# EAGLE design schematic (EAGLE 7.6.0)
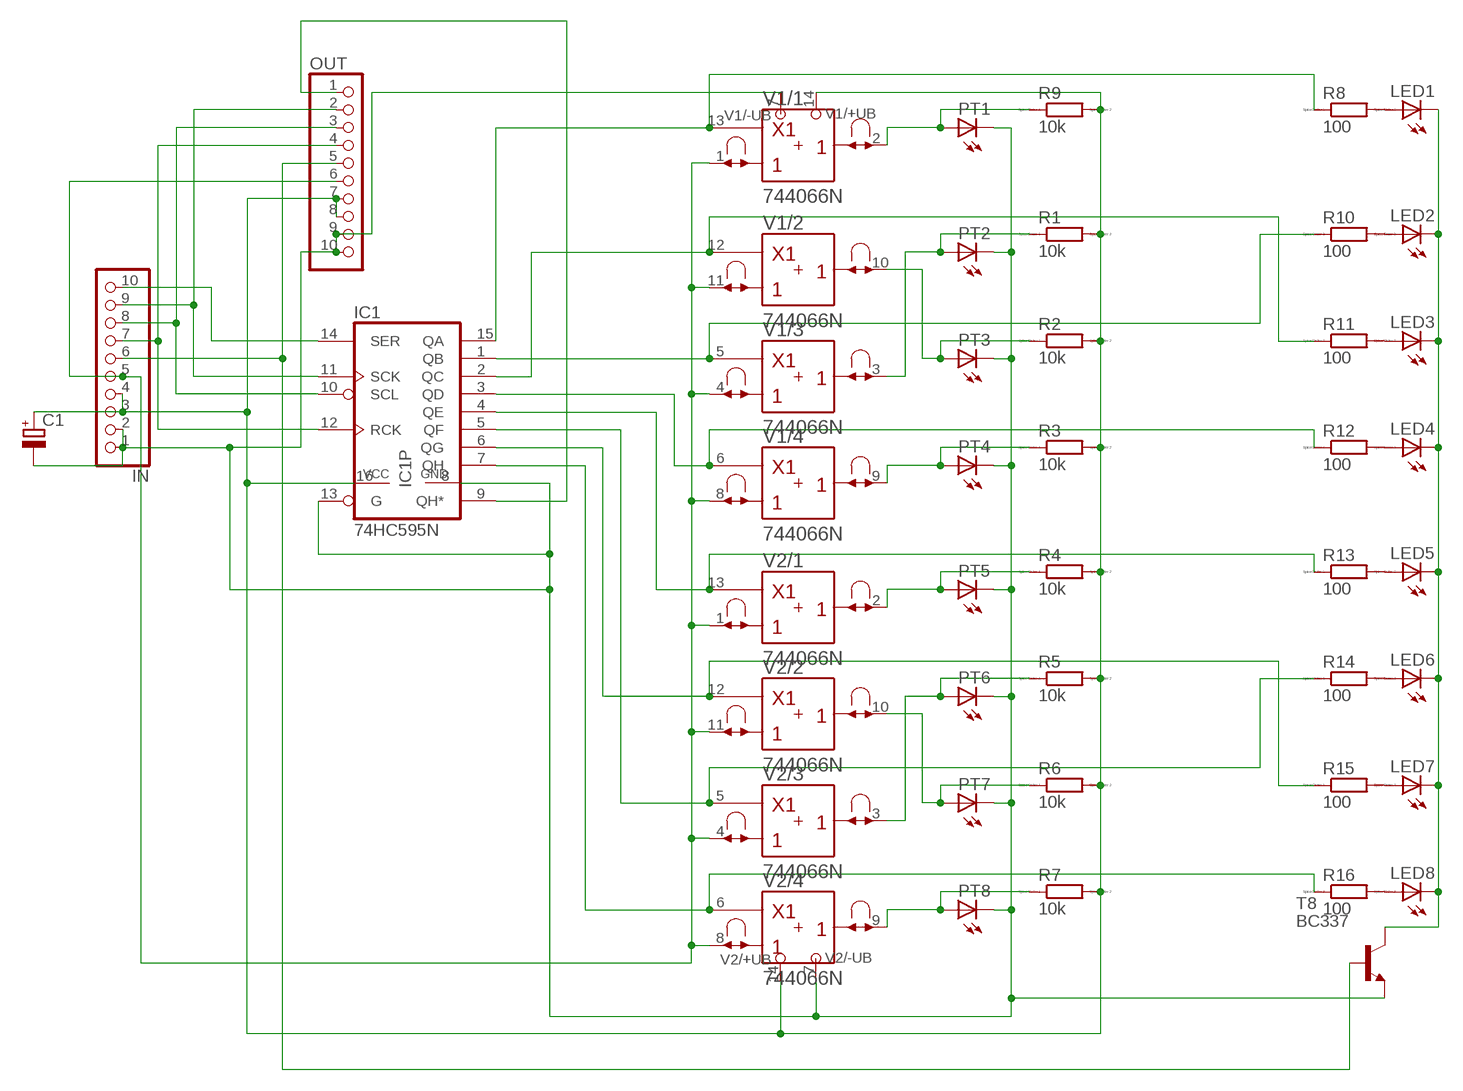
[diagram p0: schematic, sheet 1]

## Parts
C1  CPOL-EUE5-10.5  [E5-10,5]
IC1  74HC595N  [DIL16]
IN  PINHD-1X10/90  [1X10/90]
LED1  LED5MM  [LED5MM]
LED2  LED5MM  [LED5MM]
LED3  LED5MM  [LED5MM]
LED4  LED5MM  [LED5MM]
LED5  LED5MM  [LED5MM]
LED6  LED5MM  [LED5MM]
LED7  LED5MM  [LED5MM]
LED8  LED5MM  [LED5MM]
OUT  PINHD-1X10/90  [1X10/90]
PT1  LED5MM  [LED5MM]
PT2  LED5MM  [LED5MM]
PT3  LED5MM  [LED5MM]
PT4  LED5MM  [LED5MM]
PT5  LED5MM  [LED5MM]
PT6  LED5MM  [LED5MM]
PT7  LED5MM  [LED5MM]
PT8  LED5MM  [LED5MM]
R1  10k  R0204/7  [0204/7]
R2  10k  R0204/7  [0204/7]
R3  10k  R0204/7  [0204/7]
R4  10k  R0204/7  [0204/7]
R5  10k  R0204/7  [0204/7]
R6  10k  R0204/7  [0204/7]
R7  10k  R0204/7  [0204/7]
R8  100  R0204/7  [0204/7]
R9  10k  R0204/7  [0204/7]
R10  100  R0204/7  [0204/7]
R11  100  R0204/7  [0204/7]
R12  100  R0204/7  [0204/7]
R13  100  R0204/7  [0204/7]
R14  100  R0204/7  [0204/7]
R15  100  R0204/7  [0204/7]
R16  100  R0204/7  [0204/7]
T8  BC337  [TO92]
V1  744066N  [DIL14]
V2  744066N  [DIL14]

## Nets
GND: C1.- IC1.8(GND) IC1.13(G) IN.1 IN.2 OUT.9 OUT.10 PT1.K(C) PT2.K(C) PT3.K(C) PT4.K(C) PT5.K(C) PT6.K(C) PT7.K(C) PT8.K(C) T8.1(E) V1.7(/-UB:-UB) V2.7(/-UB:-UB)
N$1: IC1.15(QA) R8.1 V1.13(/1:C)
N$2: IC1.5(QF) R14.1 V2.5(/3:C)
N$3: IN.6 OUT.5 T8.2(B)
N$4: IC1.3(QD) R12.1 V1.6(/4:C)
N$5: IC1.4(QE) R13.1 V2.13(/1:C)
N$6: IC1.6(QG) R15.1 V2.12(/2:C)
N$8: IC1.7(QH) R16.1 V2.6(/4:C)
N$10: IC1.9(QH*) OUT.1
N$11: IC1.1(QB) R10.1 V1.5(/3:C)
N$12: PT8.A R7.1 V2.9(/4:B)
N$13: PT7.A R6.1 V2.10(/2:B)
N$14: PT6.A R5.1 V2.3(/3:B)
N$15: PT5.A R4.1 V2.2(/1:B)
N$16: PT4.A R3.1 V1.9(/4:B)
N$17: PT3.A R2.1 V1.10(/2:B)
N$18: PT2.A R1.1 V1.3(/3:B)
N$19: PT1.A R9.1 V1.2(/1:B)
N$20: LED1.A R8.2
N$21: IC1.10(SCL) IN.8 OUT.3
N$23: IC1.12(RCK) IN.7 OUT.4
N$24: LED2.A R10.2
N$25: IC1.11(SCK) IN.9 OUT.2
N$26: IC1.14(SER) IN.10
N$27: LED3.A R11.2
N$28: LED4.A R12.2
N$29: LED5.A R13.2
N$30: LED6.A R14.2
N$31: LED7.A R15.2
N$32: LED8.A R16.2
N$33: LED1.K(C) LED2.K(C) LED3.K(C) LED4.K(C) LED5.K(C) LED6.K(C) LED7.K(C) LED8.K(C) T8.3(C)
N$34: IC1.2(QC) R11.1 V1.12(/2:C)
N$35: IN.5 OUT.6 V1.1(/1:A) V1.4(/3:A) V1.8(/4:A) V1.11(/2:A) V2.1(/1:A) V2.4(/3:A) V2.8(/4:A) V2.11(/2:A)
VCC: C1.+ IC1.16(VCC) IN.3 IN.4 OUT.7 OUT.8 R1.2 R2.2 R3.2 R4.2 R5.2 R6.2 R7.2 R9.2 V1.14(/+UB:+UB) V2.14(/+UB:+UB)

## Library data of the parts
C1 = rcl:CPOL-EU: POLARIZED CAPACITOR, European symbol
IC1 = 74xx-eu:74*595: 8-bit SHIFT REGISTER, output latch
IN OUT = pinhead:PINHD-1X10: PIN HEADER
LED1-LED8 PT1-PT8 = led:LED: LED OSRAM: - CHIPLED LG R971, LG N971, LY N971, LG Q971, LY Q971, LO R971, LY R971 LH N974, LH R974 LS Q976, LO Q976, LY Q976 LO Q996 - Hyper CHIPLED LW Q18S LB Q993, LB Q99A, LB R99A - SideLED LS A670, LO A670, LY A670, LG A670, LP A670 LB A673, LV A673, LT A673, LW A673 LH A674 LY A675 LS A676, LA A676, LO A676, LY A676, LW A676 LS A679, LY A679, LG A679 - Hyper Micro SIDELED® LS Y876, LA Y876, LO Y876, LY Y876 LT Y87S - SmartLED LW L88C, LW L88S LB L89C, LB L89S, LG L890 LS L89K, LO L89K, LY L89K LS L896, LA L896, LO L896, LY L896 - TOPLED LS T670, LO T670, LY T670, LG T670, LP T670 LSG T670, LSP T670, LSY T670, LOP T670, LYG T670 LG T671, LOG T671, LSG T671 LB T673, LV T673, LT T673, LW T673 LH T674 LS T676, LA T676, LO T676, LY T676, LB T676, LH T676, LSB T676, LW T676 LB T67C, LV T67C, LT T67C, LS T67K, LO T67K, LY T67K, LW E67C LS E67B, LA E67B, LO E67B, LY E67B, LB E67C, LV E67C, LT E67C LW T67C LS T679, LY T679, LG T679 LS T770, LO T770, LY T770, LG T770, LP T770 LB T773, LV T773, LT T773, LW T773 LH T774 LS E675, LA E675, LY E675, LS T675 LS T776, LA T776, LO T776, LY T776, LB T776 LHGB T686 LT T68C, LB T68C - Hyper Mini TOPLED® LB M676 - Mini TOPLED Santana® LG M470 LS M47K, LO M47K, LY M47K Source: http://www.osram.convergy.de LUXEON: - LUMILED® LXK2-PW12-R00, LXK2-PW12-S00, LXK2-PW14-U00, LXK2-PW14-V00 LXK2-PM12-R00, LXK2-PM12-S00, LXK2-PM14-U00 LXK2-PE12-Q00, LXK2-PE12-R00, LXK2-PE12-S00, LXK2-PE14-T00, LXK2-PE14-U00 LXK2-PB12-K00, LXK2-PB12-L00, LXK2-PB12-M00, LXK2-PB14-N00, LXK2-PB14-P00, LXK2-PB14-Q00 LXK2-PR12-L00, LXK2-PR12-M00, LXK2-PR14-Q00, LXK2-PR14-R00 LXK2-PD12-Q00, LXK2-PD12-R00, LXK2-PD12-S00 LXK2-PH12-R00, LXK2-PH12-S00 LXK2-PL12-P00, LXK2-PL12-Q00, LXK2-PL12-R00 Source: www.luxeon.com KINGBRIGHT: KA-3528ASYC Source: www.kingbright.com
R1-R16 = eagle-ltspice:R: RESISTOR, European symbol; SPICEMODEL: NONE; SPICEPREFIX: R
T8 = transistor:BC337: NPN TRANSISTOR
V1 V2 = 74ttl-din:74*4066: Quad analog SWITCH

## Net classes
0 default: drill 0.6 mm, clearance 0.015 mm

## Board
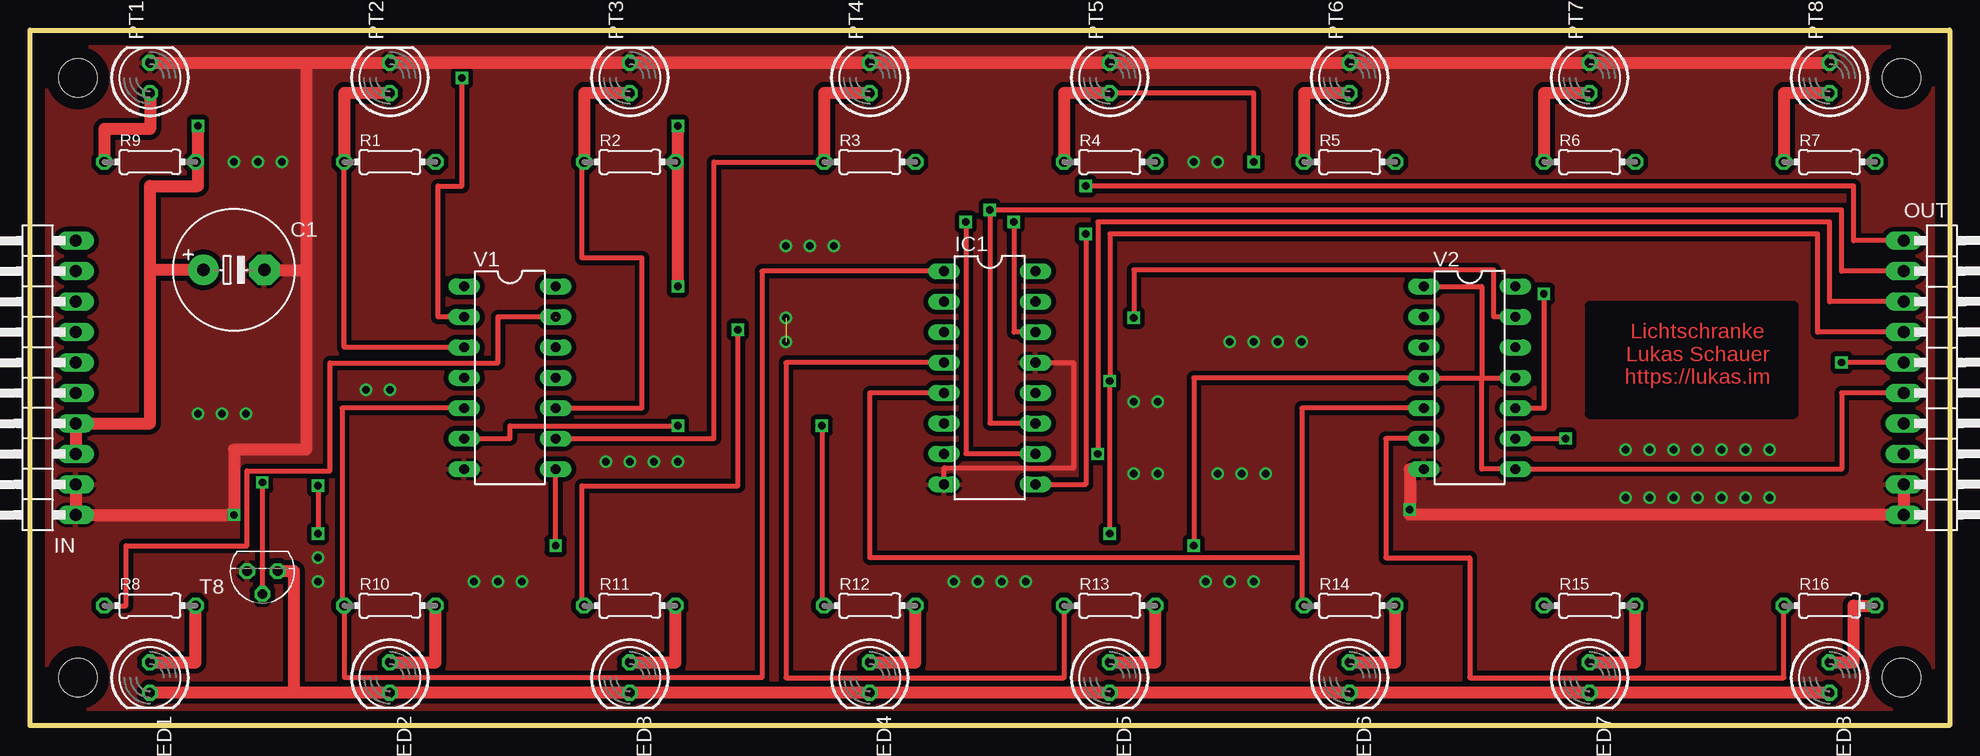
[diagram p1: board, top side]
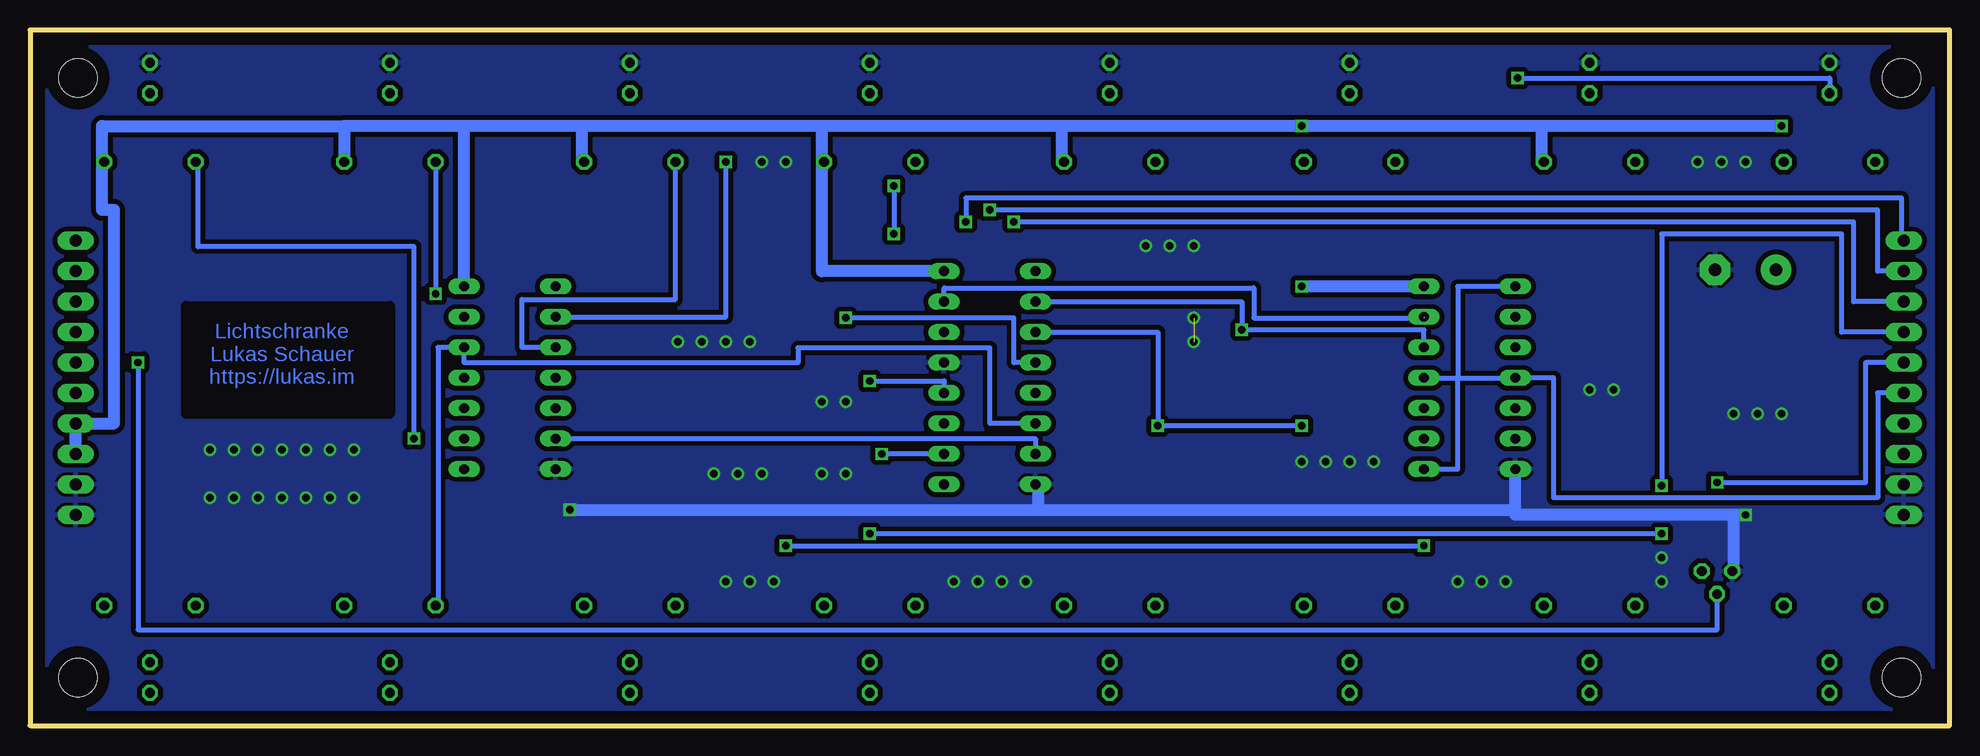
[diagram p2: board, bottom side, seen from below]

Size 160 x 58 mm. Coordinates in mm from the lower left corner, seen from the top.
Outline: 0,0 0,58 160,58 160,0 0,0
Copper layers (1*16): Top 0.035mm / dielectric 1.5mm / Bottom 0.035mm
Design rules "default *": minimum track width 10mil, minimum drill 0.6mm, track to track 8mil, track to pad 8mil, pad to pad 8mil, via to via 8mil, smd to smd 8mil, copper to edge 40mil, drill to drill 8mil, minimum pad ring 10mil, minimum via ring 8mil, stop-mask expansion 4mil, vias tented up to drill 0mil, thermal gap 10mil
Holes 3.2 mm at 4,54 4,4 156,54 156,4

### Footprints (pad centres in the part's own frame; a part is rotated, then mirrored left to right if it is on the bottom)
E5-10,5 = drill 1.016 pad 2.54: + -2.54,0 | drill 1.016 pad 2.54 octagon: - 2.54,0
DIL16 = drill 0.813 long: 1 -8.89,-3.81; 2 -6.35,-3.81; 3 -3.81,-3.81; 4 -1.27,-3.81; 5 1.27,-3.81; 6 3.81,-3.81; 7 6.35,-3.81; 8 8.89,-3.81; 9 8.89,3.81; 10 6.35,3.81; 11 3.81,3.81; 12 1.27,3.81; 13 -1.27,3.81; 14 -3.81,3.81; 15 -6.35,3.81; 16 -8.89,3.81
1X10/90 = drill 1.016 long: 1 -11.43,-3.81; 2 -8.89,-3.81; 3 -6.35,-3.81; 4 -3.81,-3.81; 5 -1.27,-3.81; 6 1.27,-3.81; 7 3.81,-3.81; 8 6.35,-3.81; 9 8.89,-3.81; 10 11.43,-3.81
LED5MM = drill 0.813 octagon: A -1.27,0; K 1.27,0
0204/7 = drill 0.813 octagon: 1 -3.81,0; 2 3.81,0
TO92 = drill 0.813 octagon: 1 1.27,0; 2 0,1.905; 3 -1.27,0
DIL14 = drill 0.813 long: 1 -7.62,-3.81; 2 -5.08,-3.81; 3 -2.54,-3.81; 4 0,-3.81; 5 2.54,-3.81; 6 5.08,-3.81; 7 7.62,-3.81; 8 7.62,3.81; 9 5.08,3.81; 10 2.54,3.81; 11 0,3.81; 12 -2.54,3.81; 13 -5.08,3.81; 14 -7.62,3.81

### Placement (x,y rotation side)
C1  17,38 0 top
IC1  80,29 270 top
IN  0,29 90 top
LED1  10,4 270 top
LED2  30,4 270 top
LED3  50,4 270 top
LED4  70,4 270 top
LED5  90,4 270 top
LED6  110,4 270 top
LED7  130,4 270 top
LED8  150,4 270 top
OUT  160,29 270 top
PT1  10,54 90 top
PT2  30,54 90 top
PT3  50,54 90 top
PT4  70,54 90 top
PT5  90,54 90 top
PT6  110,54 90 top
PT7  130,54 90 top
PT8  150,54 90 top
R1  30,47 0 top
R2  50,47 0 top
R3  70,47 0 top
R4  90,47 0 top
R5  110,47 0 top
R6  130,47 0 top
R7  150,47 0 top
R8  10,10 0 top
R9  10,47 0 top
R10  30,10 0 top
R11  50,10 0 top
R12  70,10 0 top
R13  90,10 0 top
R14  110,10 0 top
R15  130,10 0 top
R16  150,10 0 top
T8  19.37,12.87 180 top
V1  40,29 270 top
V2  120,29 270 top

### Tracks (layer width: path | path; a pad name or v marks a point on that pad's centre or on a via)
GND  (via drill 0.6)  (1 unrouted)
  Top 0.406: IC1.13 87,30.27 87,21.5 76.19,21.5 IC1.8
  Top 1: PT1.K 23,55.27 | 23,55.27 PT2.K | PT2.K PT3.K PT4.K PT5.K | PT5.K PT6.K PT7.K PT8.K | IN.2 IN.1 v17,17.57 17,23 23,23 23,38 | V2.7 115,21.38 v115,18 115,17.57 OUT.10 OUT.9 | PT5.K PT2.K | 23,55.27 23,38 | C1.- 23,38
  Bottom 1: IC1.8 76,20.11 76,18 | 76,18 36.19,18 | 36.19,18 V1.7 | v115,18 76,18 | v17,17.57 18,17.57 | 18,17.57 36.19,17.57 36.19,18 | T8.1 18,12.87 18,17.57
  other vias: 133,23 135,23 137,23 139,23 141,23 143,23 145,23 145,19 143,19 141,19 139,19 135,19 137,19 133,19 77,12 79,12 81,12 83,12 98,12 100,12 102,12 99,21 101,21 103,21 106,32 104,32 102,32 100,32 94,27 92,27 94,21 92,21 24,14 24,12 48,22 50,22 52,22 54,22 30,28 28,28 97,47 99,47 17,47 19,47 21,47 14,26 16,26 18,26 37,12 39,12 41,12 63,40 65,40 67,40 63,34 63,32
  pour Bottom (isolate 0.406): 0,58 160,58 160,0 0,0
  pour Top (isolate 0.406): 0,58 160,58 160,0 0,0
N$1  (1 unrouted)
  Top 0.406: R8.1 8,10 8,15 18.1,15 18.1,21.25 25,21.25 25,30.25 39,30.25 39,34.08 V1.13
  Bottom 0.406: 43.81,34 58,34 58,36.5 83.81,36.5 IC1.15
N$2
  Top 0.406: V2.5 106,26.46 106,14 | 106,14 106,10 | 106,14 70,14 70,27.73 IC1.5
  Top 1: 106,10 R14.1
N$3  (via drill 0.6)
  Top 0.406: v19.37,20.27 T8.2 19.37,11 | OUT.5 v151,30.27
  Bottom 0.406: IN.6 7,30.27 7,20.27 v19.37,20.27 | v151,30.27 151,8 19.37,8 T8.2
N$4  (via drill 0.6)
  Top 0.406: v66,25 66,10 | V1.6 40,23.92 40,25 v54,25
  Top 1: 66,10 R12.1
  Bottom 0.406: IC1.3 66,32.81 v66,25 v54,25
N$5  (via drill 0.6)
  Top 0.406: IC1.4 63,30.27 63,4 86.19,4 R13.1 | V2.13 122,34.08 122,38 92,38 v92,34
  Bottom 0.406: IC1.4 78,30.27 78,34 v92,34
N$6
  Bottom 0.406: 126,10 126,31.54 V2.12 123.81,30.25 96,30.25 96,31.5 80,31.5 80,25.19 IC1.6
  Bottom 1: 126,10 R15.1
N$7
  cutout Top (isolate 0.61): 130,35 130,26 147,26 147,35
N$8
  Top 0.406: V2.6 113,23.92 113,14 120,14 120,4 146.19,4 R16.1
  Bottom 0.406: V2.6 76.19,23.92 IC1.7
N$9
  cutout Bottom (isolate 0.61): 130,35 130,26 147,26 147,35
N$10  (via drill 0.6)
  Top 0.406: OUT.1 152,40.43 152,45 v88,45 | IC1.9 88,20.11 v88,41
  Bottom 0.406: v88,45 v88,41
N$11
  Top 0.406: V1.5 26,26.46 26,10 | IC1.1 61,37.89 61,4 26.19,4 R10.1
  Top 1: 26,10 R10.1
N$12  (via drill 0.6)
  Top 0.406: V2.9 v128,23.92
  Top 1: PT8.A 146.19,52.73 R7.1
  Bottom 0.406: v128,23.92 128,39.92 146,39.92 146,47 R7.1
N$13  (via drill 0.6)
  Top 0.406: v126.19,36 126.19,26.46 V2.10
  Top 1: PT7.A 126.19,52.73 R6.1
  Bottom 0.406: R6.1 v126.19,36
N$14
  Top 1: PT6.A 106.19,52.73 R5.1
  Bottom 0.406: V2.3 119,31.54 119,35.54 106.19,35.54 R5.1
N$15  (via drill 0.6)
  Top 0.406: 86.19,49 R4.1 | v102,47 102,52.73 PT5.A
  Top 1: PT5.A 86.19,52.73 R4.1
  Bottom 0.406: V2.2 102,34.08 v102,47
N$16
  Top 0.406: V1.9 57,23.92 57,47 R3.1
  Top 1: PT4.A 66.19,52.73 R3.1
N$17
  Top 0.406: V1.10 51,26.46 51,39 46,39 46,47
  Top 1: PT3.A 46.19,52.73 R2.1 46,47
N$18
  Top 0.406: V1.3 26.19,31.54 R1.1
  Top 1: PT2.A 26.19,52.73 R1.1
N$19  (via drill 0.6)
  Top 0.406: V1.2 34,34.08 34,45 36,45 v36,54
  Top 1: PT1.A 10,49.73 6.19,49.73 R9.1
  Bottom 0.406: v36,54 10,54 PT1.A
N$20
  Top 1: LED1.A 13.81,5.27 R8.2
N$21  (via drill 0.6)
  Top 0.406: v78,42 78,22.65 IC1.10 | OUT.3 150,35.35 150,42 89,42 v89,22.65
  Bottom 0.406: IN.8 8,35.35 8,42 v78,42 | IC1.10 v89,22.65
N$23  (via drill 0.6)
  Top 0.406: v24,20 v24,16 | v90,16 v90,28.73 90,41 149,41 149,32.81 OUT.4
  Bottom 0.406: IN.7 9,32.81 9,41 24,41 v24,20 | v24,16 v90,16 | v90,28.73 83.81,28.73 IC1.12
N$24
  Top 1: LED2.A 33.81,5.27 R10.2
N$25  (via drill 0.6)
  Top 0.406: IC1.11 80,25.19 v80,43 151,43 151,37.89 OUT.2
  Bottom 0.406: IN.9 6,37.89 6,43 v80,43
N$26  (via drill 0.6)
  Top 0.406: v82,42 82,32.81 IC1.14
  Bottom 0.406: 4,40.43 4,44 82,44 v82,42
  Bottom 1: IN.10 4,40.43
N$27
  Top 1: LED3.A 53.81,5.27 R11.2
N$28
  Top 1: LED4.A 73.81,5.27 R12.2
N$29
  Top 1: LED5.A 93.81,5.27 R13.2
N$30
  Top 1: LED6.A 113.81,5.27 R14.2
N$31
  Top 1: LED7.A 133.81,5.27 R15.2
N$32
  Top 1: LED8.A 152,5.27 152,10 R16.2
N$33
  Top 1: LED8.K LED7.K LED6.K LED5.K LED4.K LED3.K LED2.K 22,2.73 | 22,2.73 LED1.K | 22,2.73 22,12.87 T8.3
N$34  (via drill 0.6)
  Top 0.406: 46,10 46,20 59,20 v59,33
  Top 1: R11.1 46,10
  Bottom 0.406: IC1.2 59,35.35 v59,33 43.81,33 V1.12
N$35  (via drill 0.6)
  Top 0.406: OUT.6 151,27.73 151,21.38 V2.8 121,21.38 121,29 | 121,29 V2.11 | 121,29 V2.4 97,29 v97,15 | V2.1 121,36.62 121,29 | v43.81,15 V1.8
  Bottom 0.406: IN.5 6,27.73 6,19 33,19 33,29 V1.4 41,29 | v97,15 v43.81,15 | V1.1 41,36.62 41,29 | V1.11 41,29 | V1.8 41,21.38 41,29
VCC  (via drill 0.6)
  Top 0.813: R2.2 54,47 | R9.2 14,47
  Top 1: v54,50 54,47 v54,36.62 | v14,50 14,47 14,45 10,45 10,38 | IN.3 IN.4 10,25.19 10,38 | C1.+ 10,38
  Bottom 0.813: R7.2 154,47 | R5.2 114,47 | R4.2 94,47 | R3.2 74,47 | R1.2 34,47
  Bottom 1: 133.81,50 154,50 154,47 154,43 153,43 153,25.19 OUT.7 OUT.8 | 133.81,50 R6.2 | 114,47 114,50 | 114,50 123.81,50 | 123.81,50 133.81,50 | 94,50 94,47 94,37.89 IC1.16 | 94,50 114,50 | 74,47 74,50 | 74,50 94,50 | 74,50 v54,50 34,50 | 34,47 34,50 | v14,50 34,50 | V1.14 v54,36.62 | V2.14 123.81,50

### Text on the board
Top: Lichtschranke / Lukas Schauer / https://lukas.im
Bottom: Lichtschranke / Lukas Schauer / https://lukas.im